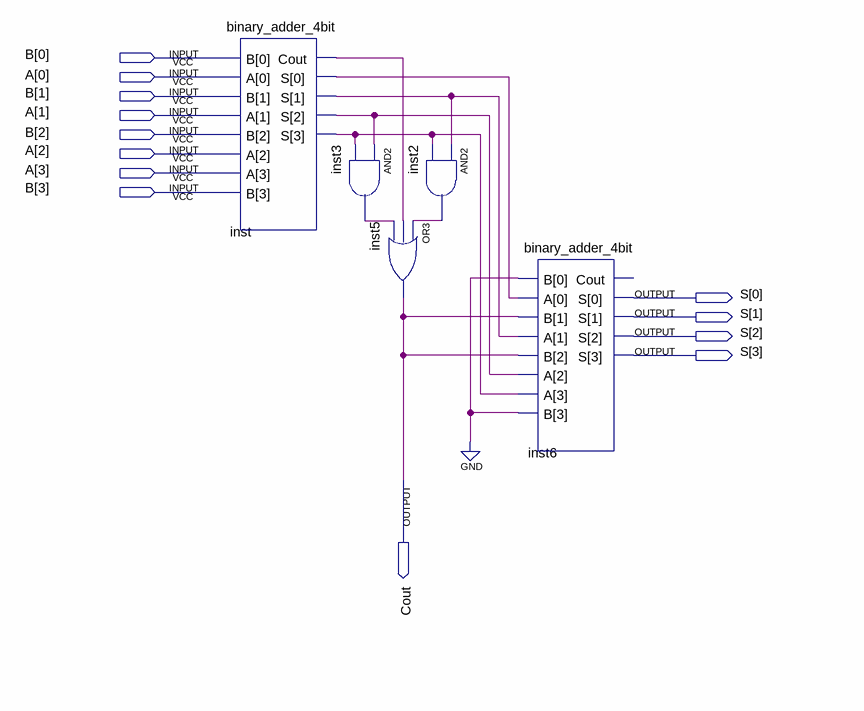
[diagram p0: schematic sheet]
// Quartus schematic bcd_adder.bdf as structural Verilog: 5 symbols, 13 pins
module bcd_adder (
  input  [3:0] B,
  input  [3:0] A,
  output [3:0] S,
  output Cout
);

  wire inst2_out, inst3_out, inst_cout, inst_s, inst_s_2, inst_s_3, inst_s_4;

  binary_adder_4bit inst (.B(B), .A(A), .Cout(inst_cout), .S({inst_s_3, inst_s, inst_s_2, inst_s_4}));
  and inst3 (inst3_out, inst_s, inst_s_3);
  and inst2 (inst2_out, inst_s_2, inst_s_3);
  or inst5 (Cout, inst2_out, inst_cout, inst3_out);
  binary_adder_4bit inst6 (
    .B({1'b0, {2{Cout}}, 1'b0}), .A({inst_s_3, inst_s, inst_s_2, inst_s_4}), .S(S));  // open: Cout
endmodule
